# EAGLE design Boss HM-2 (Swede) (EAGLE 7.3.0)
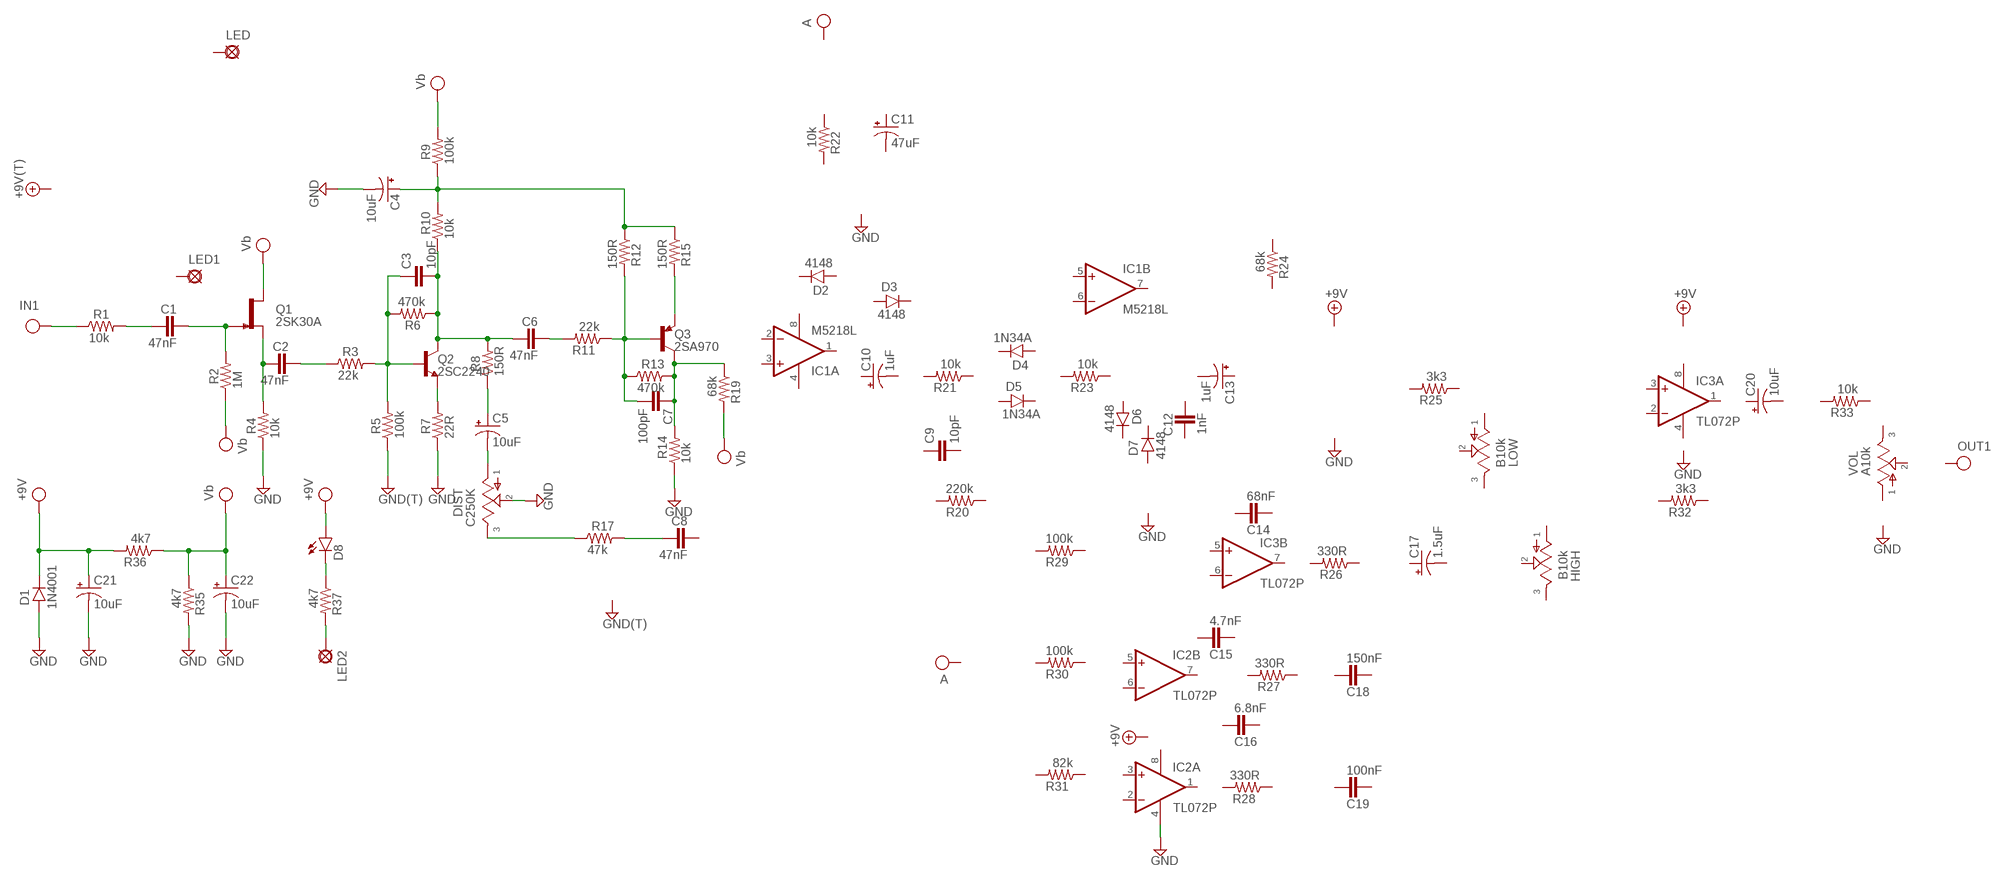
[diagram p0: schematic, sheet 1]

## Parts
+9V1  +9V(T)  [SQUARE]
C1  47nF  072X0252  [072X025]
C2  47nF  072X0252  [072X025]
C3  10pF  050X030_0251  [050X030_025]
C4  10uF  0501  [050_020_1]
C5  10uF  0501  [050_020_1]
C6  47nF  072X0252  [072X025]
C7  100pF  050X030_0251  [050X030_025]
C8  47nF  072X0252  [072X025]
C9  10pF  050X030_0251  [050X030_025]
C10  1uF  0501  [050_020_1]
C11  47uF  0501  [050_020_1]
C12  1nF  072X0252  [072X025]
C13  1uF  0501  [050_020_1]
C14  68nF  072X0252  [072X025]
C15  4.7nF  072X0252  [072X025]
C16  6.8nF  072X0252  [072X025]
C17  1.5uF  0501  [050_020_1]
C18  150nF  072X0252  [072X025]
C19  100nF  072X0252  [072X025]
C20  10uF  0501  [050_020_1]
C21  10uF  0501  [050_020_1]
C22  10uF  0501  [050_020_1]
D1  1N4001  1N4148-3  [DO35-3]
D2  4148  1N4148-3  [DO35-3]
D3  4148  1N4148-3  [DO35-3]
D4  1N34A  DO07  [DO07]
D5  1N34A  DO07  [DO07]
D6  4148  1N4148-3  [DO35-3]
D7  4148  1N4148-3  [DO35-3]
D8  LED3MM  [LED3MM]
DIST  C250K  POT16MM_PCB_PADS  [16MM_PCB_PADS]
GND1  GND(T)  [SQUARE]
GND2  GND(T)  [SQUARE]
HIGH  B10k  POT16MM_PCB_PADS  [16MM_PCB_PADS]
IC1  M5218L  TL072P  [DIL08]
IC2  TL072P  [DIL08]
IC3  TL072P  [DIL08]
IN1  IN(T)  [SQUARE]
LED  PAD  [SQUARE]
LED1  PAD  [SQUARE]
LED2  PAD  [SQUARE]
LOW  B10k  POT16MM_PCB_PADS  [16MM_PCB_PADS]
OUT1  OUT(T)  [SQUARE]
Q1  2SK30A  [TO92-]
Q2  2SC2240  2N5089  [TO92-]
Q3  2SA970  2SA733  [TO92-]
R1  10k  6MM.3  [R0207/3]
R2  1M  6MM.3  [R0207/3]
R3  22k  6MM.3  [R0207/3]
R4  10k  6MM.3  [R0207/3]
R5  100k  6MM.3  [R0207/3]
R6  470k  6MM.3  [R0207/3]
R7  22R  6MM.3  [R0207/3]
R8  150R  6MM.3  [R0207/3]
R9  100k  6MM.3  [R0207/3]
R10  10k  6MM.3  [R0207/3]
R11  22k  6MM.3  [R0207/3]
R12  150R  6MM.3  [R0207/3]
R13  470k  6MM.3  [R0207/3]
R14  10k  6MM.3  [R0207/3]
R15  150R  6MM.3  [R0207/3]
R17  47k  6MM.3  [R0207/3]
R19  68k  6MM.3  [R0207/3]
R20  220k  6MM.3  [R0207/3]
R21  10k  6MM.3  [R0207/3]
R22  10k  6MM.3  [R0207/3]
R23  10k  6MM.3  [R0207/3]
R24  68k  6MM.3  [R0207/3]
R25  3k3  6MM.3  [R0207/3]
R26  330R  6MM.3  [R0207/3]
R27  330R  6MM.3  [R0207/3]
R28  330R  6MM.3  [R0207/3]
R29  100k  6MM.3  [R0207/3]
R30  100k  6MM.3  [R0207/3]
R31  82k  6MM.3  [R0207/3]
R32  3k3  6MM.3  [R0207/3]
R33  10k  6MM.3  [R0207/3]
R35  4k7  6MM.3  [R0207/3]
R36  4k7  6MM.3  [R0207/3]
R37  4k7  6MM.3  [R0207/3]
VOL  A10k  POT16MM_PCB_PADS  [16MM_PCB_PADS]

## Nets
A: C21.+ C22.+ D1.C D8.A Q1.3(D) R2.1 R9.2 R19.2 R35.1 R36.1 R36.2 ; supply symbol labelled +9V, Vb
GND: C4.- C21.- C22.- D1.A DIST.2 GND1.1(GND) IC2.4(P:V-) R4.1 R5.1 R7.1 R14.1 R35.2
IN: IN1.1(IN) R1.1
N$1: D8.K(C) R37.1
N$2: C1.1 R1.2
N$3: C1.2 Q1.2(G) R2.2
N$4: C2.1 Q1.1(S) R4.2
N$5: C2.2 R3.1
N$6: C3.1 Q2.2(B) R3.2 R5.2 R6.2
N$7: Q2.3(E) R7.2
N$8: C3.2 C6.1 Q2.1(C) R6.1 R8.2 R10.1
N$9: C5.+ R8.1
N$10: C5.- DIST.1
N$11: LED2.1(PAD) R37.2
N$12: C4.+ R9.1 R10.2 R12.1 R15.1
N$13: C6.2 R11.2
N$14: C7.2 Q3.1(B) R11.1 R12.2 R13.1
N$15: C7.1 Q3.2(C) R13.2 R14.2 R19.1
N$16: DIST.3 R17.1
N$17: C8.1 R17.2
N$18: Q3.3(E) R15.2
Unconnected: +9V1.1(+9V) C8.2 C9.1 C9.2 C10.+ C10.- C11.+ C11.- C12.1 C12.2 C13.+ C13.- C14.1 C14.2 C15.1 C15.2 C16.1 C16.2 C17.+ C17.- C18.1 C18.2 C19.1 C19.2 C20.+ C20.- D2.A D2.C D3.A D3.C D4.A D4.C D5.A D5.C D6.A D6.C D7.A D7.C GND2.1(GND) HIGH.1 HIGH.2 HIGH.3 IC1.1(A:OUT) IC1.2(A:-IN) IC1.3(A:+IN) IC1.5(B:+IN) IC1.6(B:-IN) IC1.7(B:OUT) IC2.1(A:OUT) IC2.2(A:-IN) IC2.3(A:+IN) IC2.5(B:+IN) IC2.6(B:-IN) IC2.7(B:OUT) IC3.1(A:OUT) IC3.2(A:-IN) IC3.3(A:+IN) IC3.5(B:+IN) IC3.6(B:-IN) IC3.7(B:OUT) LED1.1(PAD) LED.1(PAD) LOW.1 LOW.2 LOW.3 OUT1.1(OUT) R20.1 R20.2 R21.1 R21.2 R22.1 R22.2 R23.1 R23.2 R24.1 R24.2 R25.1 R25.2 R26.1 R26.2 R27.1 R27.2 R28.1 R28.2 R29.1 R29.2 R30.1 R30.2 R31.1 R31.2 R32.1 R32.2 R33.1 R33.2 VOL.1 VOL.2 VOL.3

## Power pins joined to a net without a drawn wire
V+: IC1.8(P:V+) IC2.8(P:V+) IC3.8(P:V+)
V-: IC1.4(P:V-) IC3.4(P:V-)

## Library data of the parts
+9V1 = mb_supply:+9V(T): +9V Voltage Supply use this to hook up +9v throughout a schematic instead of running wire automatically labels the net "+9v" adds a hookup pad to the circuit board
C1 C2 C6 C8 C12 C14-C16 C18 C19 = mb_caps-box:072X025: 1000pF - 0.47uF WIMA MKP2 63, 100V: 1000pF - 0.015uF; MKS2 50V: 0.33 - 0.47uF; 63V: 1000pF - 0.22uF;
C3 C7 C9 = mb_caps-ceramic:050X030_025: 47 - 120pF Xicon Ceramic Disc 2.5mm lead spacing
C4 C5 C10 C11 C13 C17 C20-C22 = mb_caps-electro:050: 0.22 - 100uF Xicon values at Mouser.com: 10V: 10 - 100uF; 16V: 2.2 - 47uF; 25V: 0.47 - 47uF; 50V: 0.22 - 22uF
D1-D3 D6 D7 = mb_diodes:1N4148: Fast Switching Diode DO-35 glass case a.k.a. 1N914
D4 D5 = mb_diodes:DO07: DO-07 Package for 1N34A and similar Ge diodes
D8 = mb_diodes:LED
DIST HIGH LOW VOL = mb_pots:POT: Potentiometers the arrow indicates the clockwise motion of th wiper (lug 2) fully counter clockwise there is no resistance between lugs 1 and 2 fully clockwise the resistance between lugs 1 and 2 is the value of the pot
GND1 GND2 = mb_supply:GND(T): Ground use this to hook up ground (GND) throughout a schematic instead of running wire automatically labels the net "GND" adds a hookup pad to the circuit board (you can use several)
IC1-IC3 = mb_ics:TL072: OP AMP
IN1 = mb_supply:IN(T): Input obsolete: use Pad instead and label net shematic input label with circuit board terminal/pad generally used only once on a schematic (because this device labels the net "IN" in the same way as a voltage supply or ground net)
LED LED1 LED2 = mb_supply:PAD: PAD use this package for pads with any purpose, including input, output, send or return various pad shapes: round, square, octogonal, long, and long offset
OUT1 = mb_supply:OUT(T): Output obsolete: use Pad instead and label net output label with circuit board terminal/pad usually appears only once on a schematic
Q1 = mb_trans:2SK30A
Q2 = mb_trans:2N5089: NPN TRANSISTOR EBC pinout also works for 2N3565
Q3 = mb_trans:2SA733
R1-R15 R17 R19-R33 R35-R37 = mb_resistors:6MM: 6mm Resistors Leads spaced 1-6 holes apart for 0.1" perfboard. Suitable for 1/4 watt resistors.

## Board
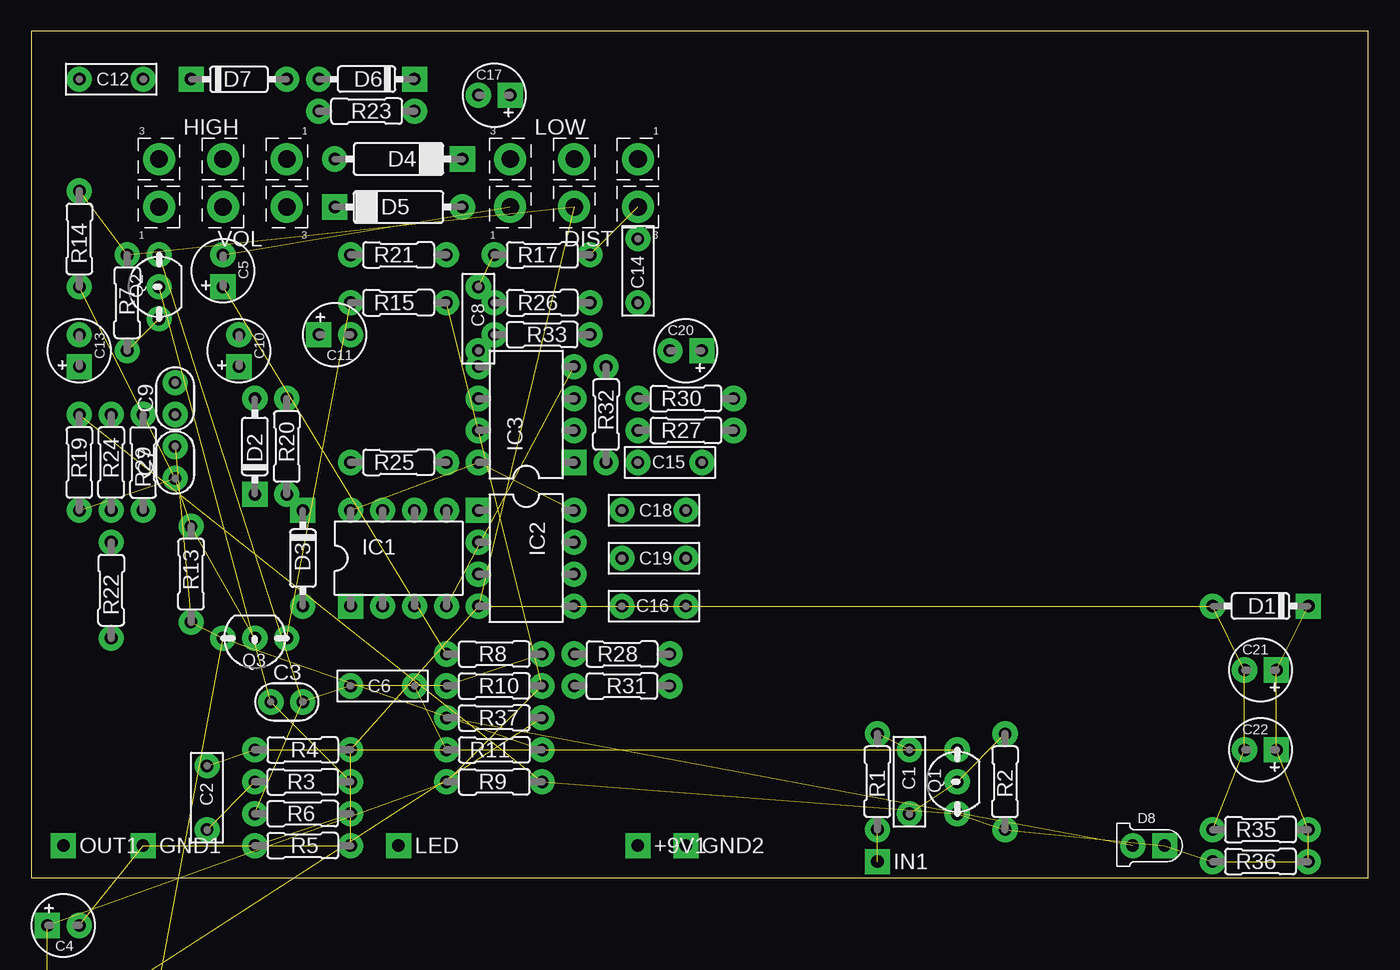
[diagram p1: board, top side]
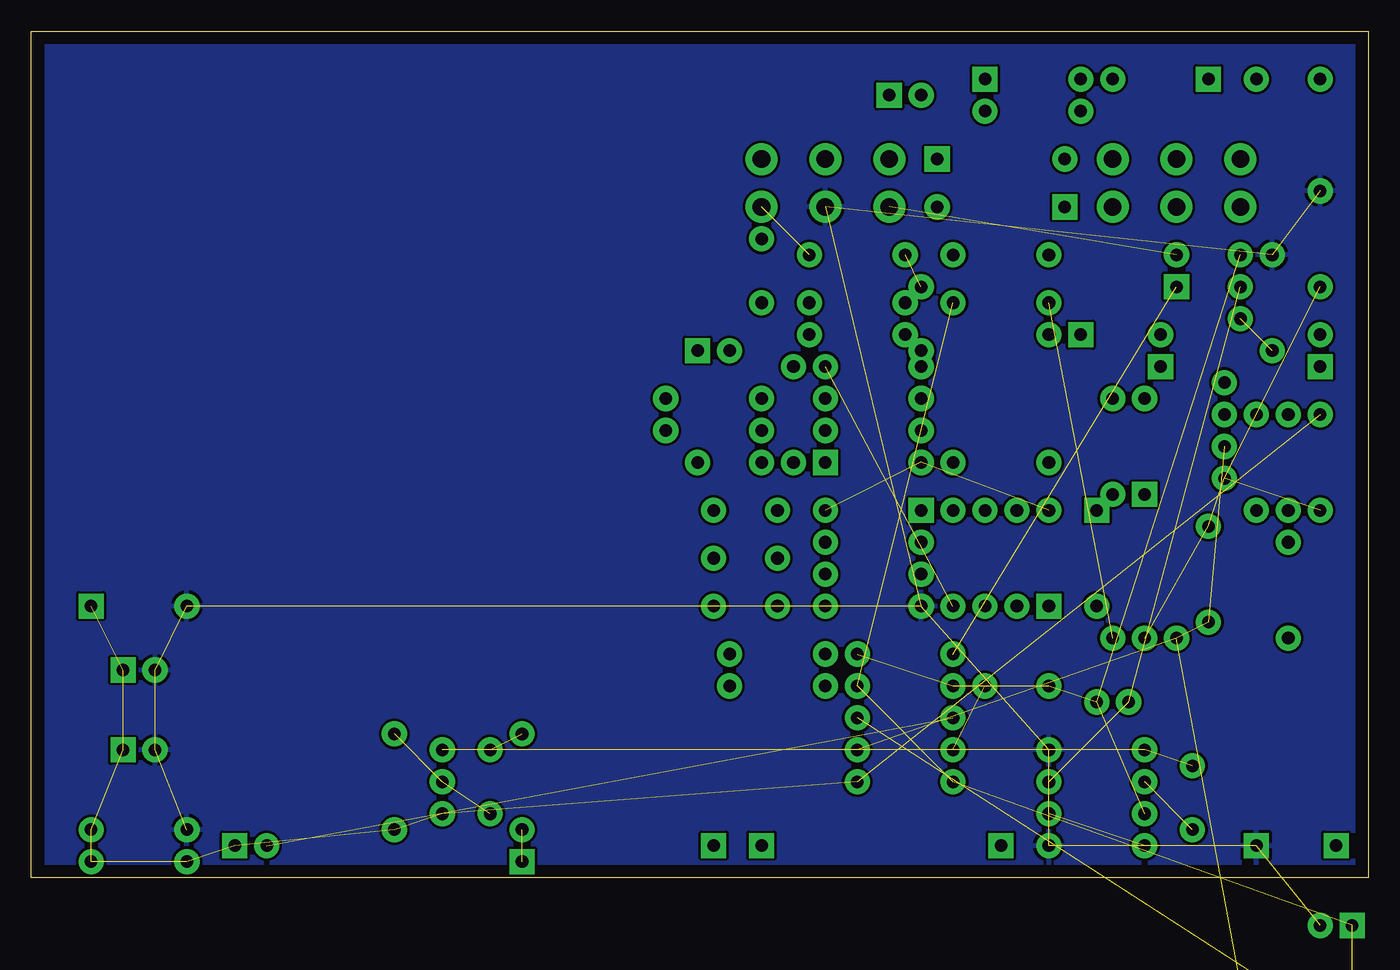
[diagram p2: board, bottom side, seen from below]

Size 106.35 x 67.3 mm. Coordinates in mm from the lower left corner, seen from the top.
Outline: 0,0 106.35,0 106.35,67.3 0,67.3 0,0
Copper layers (1*16): Top 0.035mm / dielectric 1.5mm / Bottom 0.035mm
Design rules "default": minimum track width 10mil, minimum drill 24mil, track to track 8mil, track to pad 8mil, pad to pad 8mil, via to via 8mil, smd to smd 8mil, copper to edge 40mil, drill to drill 8mil, minimum pad ring 10mil, minimum via ring 8mil, stop-mask expansion 4mil, vias tented up to drill 0mil, thermal gap 10mil

### Footprints (pad centres in the part's own frame; a part is rotated, then mirrored left to right if it is on the bottom)
SQUARE = drill 1 pad 2 square: 1 0,0
072X025 = drill 1 pad 2: 1 -2.54,0; 2 2.54,0
050X030_025 = drill 1 pad 2: 1 -1.27,0; 2 1.27,0
050_020_1 = drill 1 pad 2 square: + -1.27,0 | drill 1 pad 2: - 1.27,0
DO35-3 = drill 1 pad 2: A 3.81,0 | drill 1 pad 2 square: C -3.81,0
DO07 = drill 1 pad 2: A 5.08,0 | drill 1 pad 2 square: C -5.08,0
LED3MM = drill 1 pad 2 square: A -1.27,0 | drill 1 pad 2: K 1.27,0
16MM_PCB_PADS = drill 1.4 pad 2.54: 1 5.08,0; 2 0,0; 3 -5.08,0
DIL08 = drill 1 pad 2 square: 1 -3.81,-3.81 | drill 1 pad 2: 2 -1.27,-3.81; 3 1.27,-3.81; 4 3.81,-3.81; 5 3.81,3.81; 6 1.27,3.81; 7 -1.27,3.81; 8 -3.81,3.81
TO92- = drill 1 pad 2: 1 2.54,0; 2 0,0; 3 -2.54,0
R0207/3 = drill 1 pad 2: 1 -3.81,0; 2 3.81,0

### Placement (x,y rotation side)
+9V1  48.26,2.54 0 top
C1  69.85,7.62 270 top
C2  13.97,6.35 270 top
C3  20.32,13.97 0 top
C4  2.54,-3.81 0 top  (outside the outline)
C5  15.24,48.26 90 top
C6  27.94,15.24 0 top
C7  11.43,33.02 90 top
C8  35.56,44.45 270 top
C9  11.43,38.1 90 top
C10  16.51,41.91 90 top
C11  24.13,43.18 0 top
C12  6.35,63.5 0 top
C13  3.81,41.91 90 top
C14  48.26,48.26 270 top
C15  50.8,33.02 180 top
C16  49.53,21.59 180 top
C17  36.83,62.23 180 top
C18  49.53,29.21 0 top
C19  49.53,25.4 0 top
C20  52.07,41.91 180 top
C21  97.79,16.51 180 top
C22  97.79,10.16 180 top
D1  97.79,21.59 180 top
D2  17.78,34.29 90 top
D3  21.59,25.4 270 top
D4  29.21,57.15 180 top
D5  29.21,53.34 0 top
D6  26.67,63.5 180 top
D7  16.51,63.5 0 top
D8  88.9,2.54 180 top
DIST  43.18,53.34 180 top
GND1  8.89,2.54 0 top
GND2  52.07,2.54 0 top
HIGH  15.24,57.15 0 top
IC1  29.21,25.4 0 top
IC2  39.37,25.4 270 top
IC3  39.37,36.83 90 top
IN1  67.31,1.27 0 top
LED  29.21,2.54 0 top
LED1  1.27,-10.16 0 top  (outside the outline)
LED2  1.27,-12.7 0 top  (outside the outline)
LOW  43.18,57.15 0 top
OUT1  2.54,2.54 0 top
Q1  73.66,7.62 90 top
Q2  10.16,46.99 90 top
Q3  17.78,19.05 180 top
R1  67.31,7.62 90 top
R2  77.47,7.62 90 top
R3  21.59,7.62 0 top
R4  21.59,10.16 180 top
R5  21.59,2.54 180 top
R6  21.59,5.08 0 top
R7  7.62,45.72 270 top
R8  36.83,17.78 0 top
R9  36.83,7.62 0 top
R10  36.83,15.24 0 top
R11  36.83,10.16 180 top
R12  5.08,-15.24 0 top  (outside the outline)
R13  12.7,24.13 90 top
R14  3.81,50.8 270 top
R15  29.21,45.72 180 top
R17  40.64,49.53 180 top
R19  3.81,33.02 90 top
R20  20.32,34.29 90 top
R21  29.21,49.53 180 top
R22  6.35,22.86 270 top
R23  26.67,60.96 0 top
R24  6.35,33.02 90 top
R25  29.21,33.02 180 top
R26  40.64,45.72 180 top
R27  52.07,35.56 180 top
R28  46.99,17.78 180 top
R29  8.89,33.02 270 top
R30  52.07,38.1 180 top
R31  46.99,15.24 0 top
R32  45.72,36.83 90 top
R33  40.64,43.18 0 top
R35  97.79,3.81 180 top
R36  97.79,1.27 180 top
R37  36.83,12.7 0 top
VOL  15.24,53.34 180 top

### Tracks (layer width: path | path; a pad name or v marks a point on that pad's centre or on a via)
A  (10 unrouted)
GND  (11 unrouted)
  pour Bottom: 0,67.31 0,0 105.41,0 105.41,67.31
IN  (1 unrouted)
N$1  (1 unrouted)
N$2  (1 unrouted)
N$3  (2 unrouted)
N$4  (2 unrouted)
N$5  (1 unrouted)
N$6  (4 unrouted)
N$7  (1 unrouted)
N$8  (5 unrouted)
N$9  (1 unrouted)
N$10  (1 unrouted)
N$11  (1 unrouted)
N$12  (4 unrouted)
N$13  (1 unrouted)
N$14  (4 unrouted)
N$15  (4 unrouted)
N$16  (1 unrouted)
N$17  (1 unrouted)
N$18  (1 unrouted)
V+  (2 unrouted)
V-  (1 unrouted)